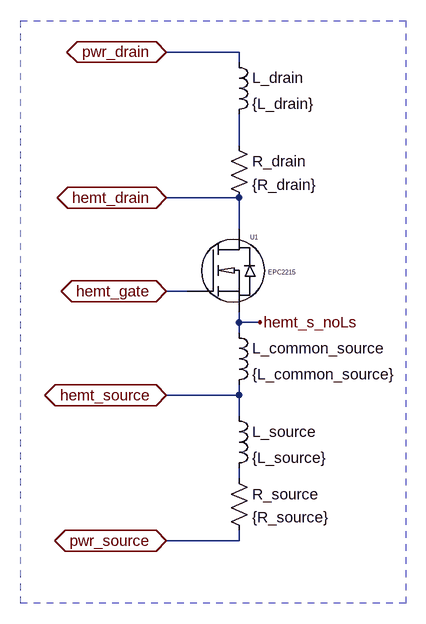
[diagram p0: schematic hemt_cell_V1.asc]
hemt_cell_V1.asc, the LTspice schematic file:
Version 4.1
SHEET 1 1704 680
WIRE 672 -352 560 -352
WIRE 672 -336 672 -352
WIRE 672 -208 672 -256
WIRE 672 -128 560 -128
WIRE 672 -80 672 -128
WIRE 592 16 560 16
WIRE 672 64 672 48
WIRE 704 64 672 64
WIRE 672 80 672 64
WIRE 672 176 672 160
WIRE 672 176 560 176
WIRE 672 208 672 176
WIRE 672 304 672 288
WIRE 672 400 672 384
WIRE 672 400 560 400
FLAG 560 176 hemt_source
IOPIN 560 176 BiDir
FLAG 560 16 hemt_gate
IOPIN 560 16 BiDir
FLAG 560 -128 hemt_drain
IOPIN 560 -128 BiDir
FLAG 560 -352 pwr_drain
IOPIN 560 -352 BiDir
FLAG 560 400 pwr_source
IOPIN 560 400 BiDir
FLAG 704 64 hemt_s_noLs
SYMBOL EPCGaN 592 16 R0
SYMATTR InstName U1
SYMATTR Value EPC2215
SYMBOL res 656 -224 R0
SYMATTR InstName R_drain
SYMATTR Value {R_drain}
SYMBOL ind 656 -352 R0
SYMATTR InstName L_drain
SYMATTR Value {L_drain}
SYMBOL ind 656 192 R0
SYMATTR InstName L_source
SYMATTR Value {L_source}
SYMBOL res 656 288 R0
SYMATTR InstName R_source
SYMATTR Value {R_source}
SYMBOL ind 656 64 R0
SYMATTR InstName L_common_source
SYMATTR Value {L_common_source}
RECTANGLE Normal 928 496 336 -400 3

The netlist it stands for:
* hemt_cell_V1.asc
X§U1 hemt_gate hemt_drain hemt_s_noLs EPC2215  ; pins gatein drainin sourcein
R_drain N001 hemt_drain {R_drain}
L_drain pwr_drain N001 {L_drain}
L_source hemt_source N002 {L_source}
R_source N002 pwr_source {R_source}
L_common_source hemt_s_noLs hemt_source {L_common_source}
.lib EPCGanlibrary.lib
.backanno
.end